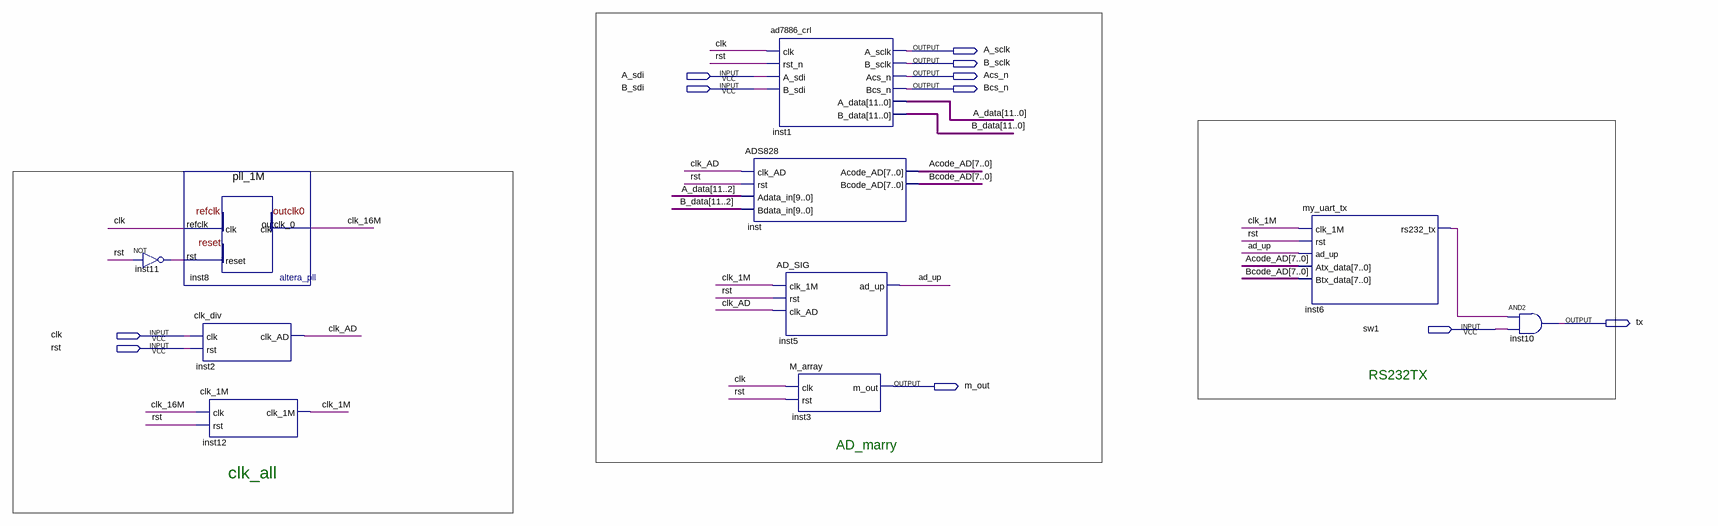
[diagram p0: schematic sheet]
// Quartus schematic psk.bdf as structural Verilog: 10 symbols, 11 pins
module psk (
  input  A_sdi,
  input  B_sdi,
  input  sw1,
  input  clk,
  input  rst,
  output A_sclk,
  output B_sclk,
  output Acs_n,
  output Bcs_n,
  output tx,
  output m_out
);

  wire ad_up, clk_1M, clk_16M, clk_AD, inst6_rs232_tx, inst11_out;
  wire [7:0] Acode_AD, Bcode_AD;
  wire [11:0] A_data, B_data;

  not inst11 (inst11_out, rst);
  pll_1M inst8 (.refclk(clk), .rst(inst11_out), .outclk_0(clk_16M));
  clk_div inst2 (.clk(clk), .rst(rst), .clk_AD(clk_AD));
  clk_1M inst12 (.clk(clk_16M), .rst(rst), .clk_1M(clk_1M));
  ad7886_crl inst1 (
    .clk(clk), .rst_n(rst), .A_sdi(A_sdi), .B_sdi(B_sdi), .A_sclk(A_sclk), .B_sclk(B_sclk), .Acs_n(Acs_n),
    .Bcs_n(Bcs_n), .A_data(A_data), .B_data(B_data));
  ADS828 inst (
    .clk_AD(clk_AD), .rst(rst), .Adata_in(A_data[11:2]), .Bdata_in(B_data[11:2]), .Acode_AD(Acode_AD),
    .Bcode_AD(Bcode_AD));
  AD_SIG inst5 (.clk_1M(clk_1M), .rst(rst), .clk_AD(clk_AD), .ad_up(ad_up));
  M_array inst3 (.clk(clk), .rst(rst), .m_out(m_out));
  my_uart_tx inst6 (
    .clk_1M(clk_1M), .rst(rst), .ad_up(ad_up), .Atx_data(Acode_AD), .Btx_data(Bcode_AD),
    .rs232_tx(inst6_rs232_tx));
  and inst10 (tx, inst6_rs232_tx, sw1);

  // Notes on the sheet:
  //   RS232TX
  //   AD_marry
  //   clk_all
endmodule
